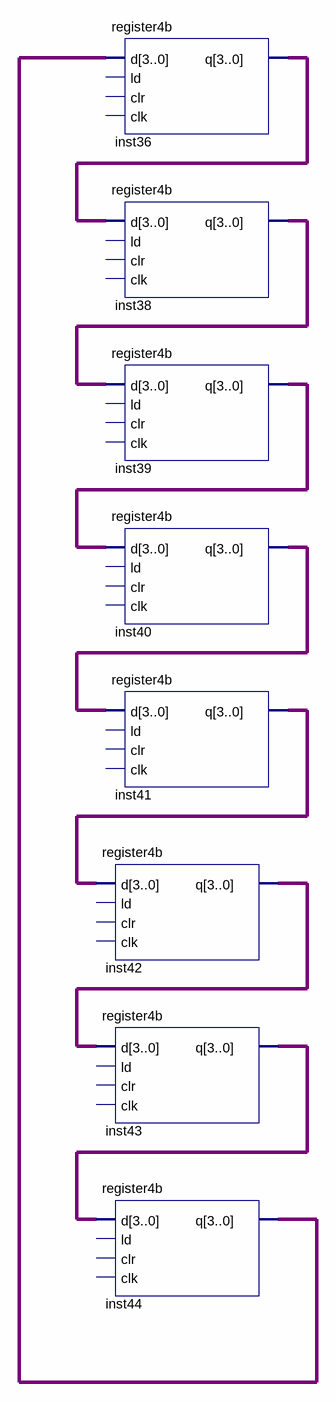
[diagram p0: schematic sheet]
// Quartus schematic aux_berleys.bdf as structural Verilog: 8 symbols, 0 pins
module aux_berleys (
);

  wire [3:0] inst36_q, inst38_q, inst39_q, inst40_q, inst41_q, inst42_q, inst43_q, inst44_q;

  register4b inst36 (.d(inst44_q), .q(inst36_q));  // open: ld, clr, clk
  register4b inst38 (.d(inst36_q), .q(inst38_q));  // open: ld, clr, clk
  register4b inst39 (.d(inst38_q), .q(inst39_q));  // open: ld, clr, clk
  register4b inst40 (.d(inst39_q), .q(inst40_q));  // open: ld, clr, clk
  register4b inst41 (.d(inst40_q), .q(inst41_q));  // open: ld, clr, clk
  register4b inst42 (.d(inst41_q), .q(inst42_q));  // open: ld, clr, clk
  register4b inst43 (.d(inst42_q), .q(inst43_q));  // open: ld, clr, clk
  register4b inst44 (.d(inst43_q), .q(inst44_q));  // open: ld, clr, clk
endmodule
